# EAGLE schematic temp-monitor (EAGLE 6.3)
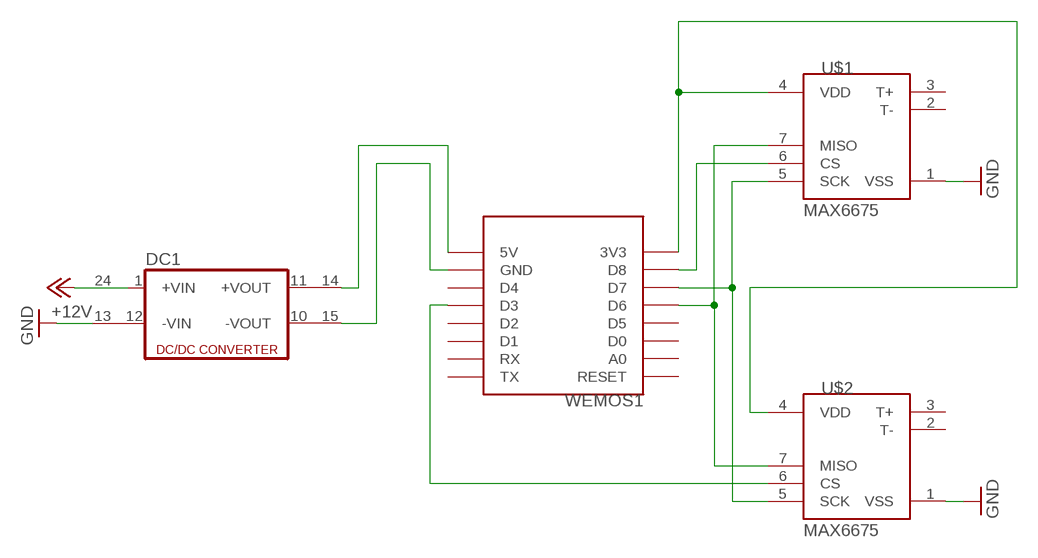
[diagram p0: schematic, sheet 1]

## Parts
DC1  DC213R  [CMK]
U$1  MAX6675  [SO08]
U$2  MAX6675  [SO08]
WEMOS1  WEMOS-D1-MINI  [WEMOS-D1-MINI]

## Nets
+12V: DC1.1(+VIN) DC1.24(+VIN1)
GND: DC1.13(-VIN1) U$1.1(VSS) U$2.1(VSS)
N$1: DC1.14(+VOUT1) WEMOS1.5V
N$2: DC1.15(-VOUT1) WEMOS1.GND
N$3: U$1.7(MISO) U$2.7(MISO) WEMOS1.D6
N$4: U$1.5(SCK) U$2.5(SCK) WEMOS1.D7
N$5: U$1.6(CS) WEMOS1.D8
N$6: U$2.6(CS) WEMOS1.D3
N$7: U$1.4(VDD) U$2.4(VDD) WEMOS1.3V3
Unconnected: DC1.10(-VOUT) DC1.11(+VOUT) DC1.12(-VIN) U$1.2(T-) U$1.3(T+) U$2.2(T-) U$2.3(T+) WEMOS1.A0 WEMOS1.D0 WEMOS1.D1 WEMOS1.D2 WEMOS1.D4 WEMOS1.D5 WEMOS1.RESET WEMOS1.RX WEMOS1.TX

## Library data of the parts
DC1 = dc-dc-converter:DC213R: DC-DC CONVERTER; OC_FARNELL: unknown; OC_NEWARK: unknown
U$1 U$2 = max6675:MAX6675
WEMOS1 = esp8266modules:WEMOS-D1-MINI: WeMos.cc D1 mini ESP8266 module